# EAGLE design Controller (EAGLE 9.6.2)
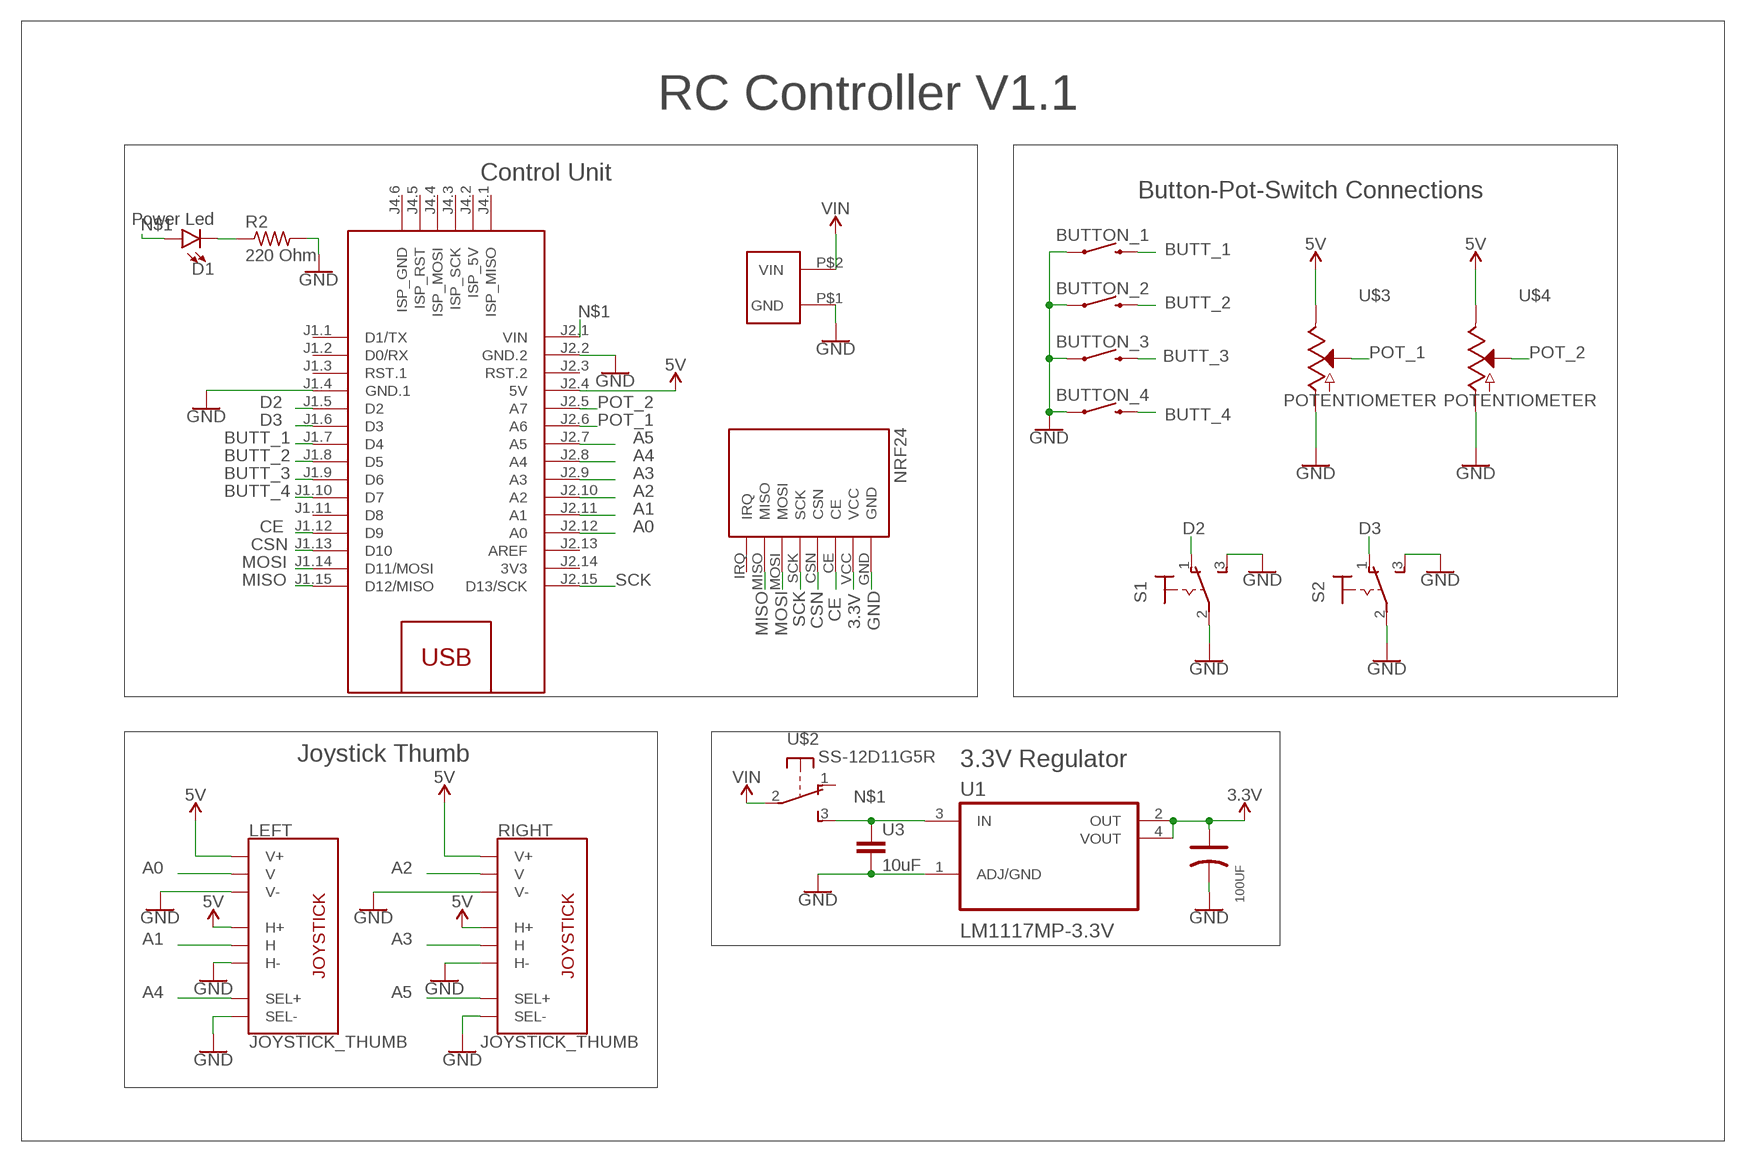
[diagram p0: schematic, sheet 1]

## Parts
BUTTON_1  MOMENTARY-SWITCH-SPST-PTH-6.0MM  [TACTILE_SWITCH_PTH_6.0MM]
BUTTON_2  MOMENTARY-SWITCH-SPST-PTH-6.0MM  [TACTILE_SWITCH_PTH_6.0MM]
BUTTON_3  MOMENTARY-SWITCH-SPST-PTH-6.0MM  [TACTILE_SWITCH_PTH_6.0MM]
BUTTON_4  MOMENTARY-SWITCH-SPST-PTH-6.0MM  [TACTILE_SWITCH_PTH_6.0MM]
D1  Power Led  LED-RED1206  [LED-1206]
LEFT  JOYSTICK_THUMB  [JOYSTICK]
M1  ARDUINO-NANO-3.0#ISP  [ARDUINO-NANO-3.0#ISP]
R2  220 Ohm  ERJ-8GEY0R00V  [RES_1206]
RIGHT  JOYSTICK_THUMB  [JOYSTICK]
S1  320-916  [320-916]
S2  320-916  [320-916]
U1  LM1117MP-3.3V  LM1117MP-5.0  [SOT230P700X180-4N]
U2  100UF  [8X10MM]
U3  10uF  10UF-1206-6.3V-20%  [1206]
U$1  VIN  [SMD_VIN]
U$2  SS-12D11G5R  [SWITCH]
U$3  POTENTIOMETER  [POTENTIOMETER]
U$4  POTENTIOMETER  [POTENTIOMETER]
U$5  NRF24  [NRF24]

## Nets
3.3V: U1.2(OUT) U1.4(VOUT) U2.1(+) U$5.VCC
5V: LEFT.H1(H+) LEFT.V1(V+) M1.J2.4(5V) RIGHT.H1(H+) RIGHT.V1(V+) U$3.1 U$4.1
A0: LEFT.V2(V) M1.J2.12(A0)
A1: LEFT.H2(H) M1.J2.11(A1)
A2: M1.J2.10(A2) RIGHT.V2(V)
A3: M1.J2.9(A3) RIGHT.H2(H)
A4: LEFT.B1A(SEL+) M1.J2.8(A4)
A5: M1.J2.7(A5) RIGHT.B1A(SEL+)
BUTT_1: BUTTON_1.3 M1.J1.7(D4)
BUTT_2: BUTTON_2.3 M1.J1.8(D5)
BUTT_3: BUTTON_3.3 M1.J1.9(D6)
BUTT_4: BUTTON_4.3 M1.J1.10(D7)
CE: M1.J1.12(D9) U$5.CE
CSN: M1.J1.13(D10) U$5.CSN
D2: M1.J1.5(D2) S1.1(O)
D3: M1.J1.6(D3) S2.1(O)
GND: BUTTON_1.1 BUTTON_2.1 BUTTON_3.1 BUTTON_4.1 LEFT.B2A(SEL-) LEFT.H3(H-) LEFT.V3(V-) M1.J1.4(GND.1) M1.J2.2(GND.2) R2.2 RIGHT.B2A(SEL-) RIGHT.H3(H-) RIGHT.V3(V-) S1.2(P) S1.3(S) S2.2(P) S2.3(S) U1.1(ADJ/GND) U2.2(-) U3.2 U$1.P$1(GND) U$3.3 U$4.3 U$5.GND
MISO: M1.J1.15(D12/MISO) U$5.MISO
MOSI: M1.J1.14(D11/MOSI) U$5.MOSI
N$1: D1.A M1.J2.1(VIN) U1.3(IN) U3.1 U$2.3(S)
N$2: D1.C R2.1
POT_1: M1.J2.6(A6) U$3.2
POT_2: M1.J2.5(A7) U$4.2
SCK: M1.J2.15(D13/SCK) U$5.SCK
VIN: U$1.P$2(VIN) U$2.2(P)
Unconnected: M1.J1.1(D1/TX) M1.J1.2(D0/RX) M1.J1.3(RST.1) M1.J1.11(D8) M1.J2.3(RST.2) M1.J2.13(AREF) M1.J4.1(ISP_MISO) M1.J4.2(ISP_5V) M1.J4.3(ISP_SCK) M1.J4.4(ISP_MOSI) M1.J4.5(ISP_RST) M1.J4.6(ISP_GND) U$2.1(O) U$5.IRQ

## Notes on the sheet
- RC Controller V1.1
- Control Unit
- Button-Pot-Switch Connections
- Joystick Thumb | 3.3V Regulator

## Power pins joined to a net without a drawn wire
3V3: M1.J2.14(3V3)

## Library data of the parts
BUTTON_1-BUTTON_4 = SparkFun-Switches:MOMENTARY-SWITCH-SPST: Momentary Switch (Pushbutton) - SPST Normally-open (NO) SPST momentary switches (buttons, pushbuttons). Variants PTH-12MM - 12mm square, through-hole Momentary Pushbutton Switch - 12mm Square <https://www.sparkfun.com/products/9190> (COM-09190) PTH-6.0MM, PTH-6.0MM-KIT - 6.0mm square, through-hole Mini Pushbutton Switch <https://www.sparkfun.com/products/97> (COM-00097) KIT package intended for soldering kit's - only one side of pads' copper is exposed. PTH-RIGHT-ANGLE-KIT - Right-angle, through-hole Right Angle Tactile Button <https://www.sparkfun.com/products/10791> - Used on SparkFun BigTime Watch Kit <https://www.sparkfun.com/products/11734> SMD-12MM - 12mm square, surface-mount Tactile Button - SMD (12mm) <https://www.sparkfun.com/products/12993> (COM-12993) Used on SparkFun PicoBoard <https://www.sparkfun.com/products/11888> SMD-4.5MM - 4.5mm Square Trackball Switch Used on SparkFun Blackberry Trackballer Breakout <https://www.sparkfun.com/products/13169> SMD-4.6MMX2.8MM - 4.60mm x 2.80mm, surface mount Used on SparkFun SAMD21 Mini Breakout <https://www.sparkfun.com/products/13664> SMD-5.2MM, SMD-5.2-REDUNDANT - 5.2mm square, surface-mount Mini Pushbutton Switch - SMD <https://www.sparkfun.com/products/8720> (COM-08720) Used on Arduino Pro Mini <https://www.sparkfun.com/products/11114> REDUNDANT package connects both switch circuits together SMD-6.0X3.5MM - 6.0 x 3.5mm, surface mount Momentary Reset Switch SMD <https://www.sparkfun.com/products/8229> (COM-08229) SMD-6.2MM-TALL - 6.2mm square, surface mount Tactile Button - SMD (6mm) <https://www.sparkfun.com/products/12992> Used on SparkFun Digital Sandbox <https://www.sparkfun.com/products/12651> SMD-RIGHT-ANGLE - Right-angle, surface mount Used on SparkFun Block for Intel® Edison - Arduino <https://www.sparkfun.com/products/13036>; PROD_ID: SWCH-08441; SF_SKU: COM-00097
D1 = SparkFun-LED:LED-RED: Red SMD LED Used in manufacturing of most products at SparkFun Packages: 0603 - SMD 0603 package [Product Link] <http://docs.avagotech.com/docs/AV02-0551EN> 0603 SMART - SMD 0603 SMART package ( more efficient and expensive)[Product Link] <http://www.osram-os.com/Graphics/XPic2/00077099_0.pdf> 1206 - SMD1206 package [Product Link] <https://www.sparkfun.com/datasheets/DevTools/LilyPad/Q150OVS4.pdff> SparkFun Products: Pro Mini 328 -5V <https://www.sparkfun.com/products/821> RedBoard <https://www.sparkfun.com/products/12757> IOIO-OTG <https://www.sparkfun.com/products/13613>; PROD_ID: DIO-09912; VALUE: RED
LEFT RIGHT = SparkFun-Switches:JOYSTICK_THUMB: Analog Thumb Joystick This is a joystick very similar to the ‘analog’ joysticks on PS2 (PlayStation 2) controllers. Directional movements are simply two potentiometers - one for each axis. Pots are ~10k each. This joystick also has a select button that is actuated when the joystick is pressed down. SparkFun Products Thumb Joystick <https://www.sparkfun.com/products/9032> (COM-09032) SparkFun Thumb Joystick Breakout <https://www.sparkfun.com/products/9110> (BOB-09110) SparkFun Joystick Shield Kit <https://www.sparkfun.com/products/9760> (DEV-09760); PROD_ID: COMP-09744; SF_SKU: COM-09032
M1 = diy-modules:ARDUINO-NANO-3.0#ISP: Arduino Nano 3.0 with ISP pads
R2 = Resistor_Capacitor:ERJ-8GEY0R00V: RES SMD 0 OHM JUMPER 1/4W 1206 Manufacturer's datasheet <https://industrial.panasonic.com/ww/products/resistors/chip-resistors/general-purpose-chip-resistors/thick-film-chip-resistors/ERJ8GEY0R00V>; CREATED_BY: PCBLayout.com; DIGIKEY_PART_NUMBER: P0.0ETR-ND; MANUFACTURER: Panasonic Electronic Components; MPN: ERJ-8GEY0R00V; PACKAGE: SMD 1206
S1 S2 = nrf24:320-916: TOGGLE SWITCH distributor RS Components
U1 = SnapEDA Library:LM1117MP-5.0
U2 = nrf24:100UF
U3 = SparkFun-Capacitors:10UF: 10.0µF ceramic capacitors A capacitor is a passive two-terminal electrical component used to store electrical energy temporarily in an electric field.; PROD_ID: CAP-10057
U$1 = nrf24:VIN
U$2 = nrf24:SS-12D11G5R
U$3 U$4 = nrf24:POTENTIOMETER
U$5 = nrf24:NRF24

## Net classes
0 default: width 0.61 mm

## Board
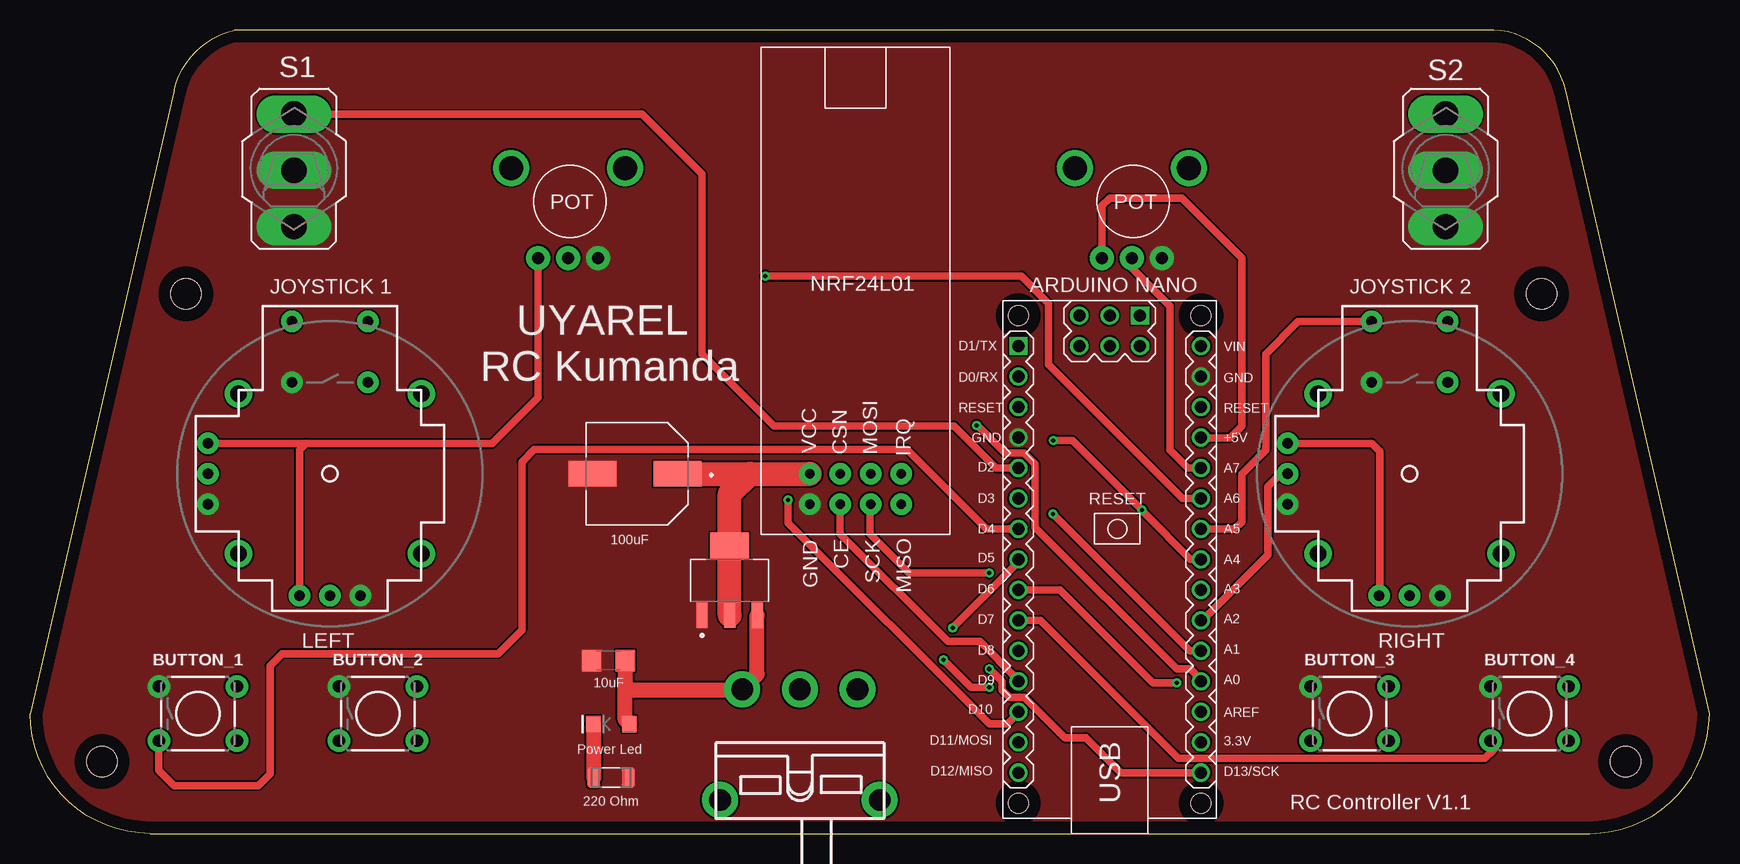
[diagram p1: board, top side]
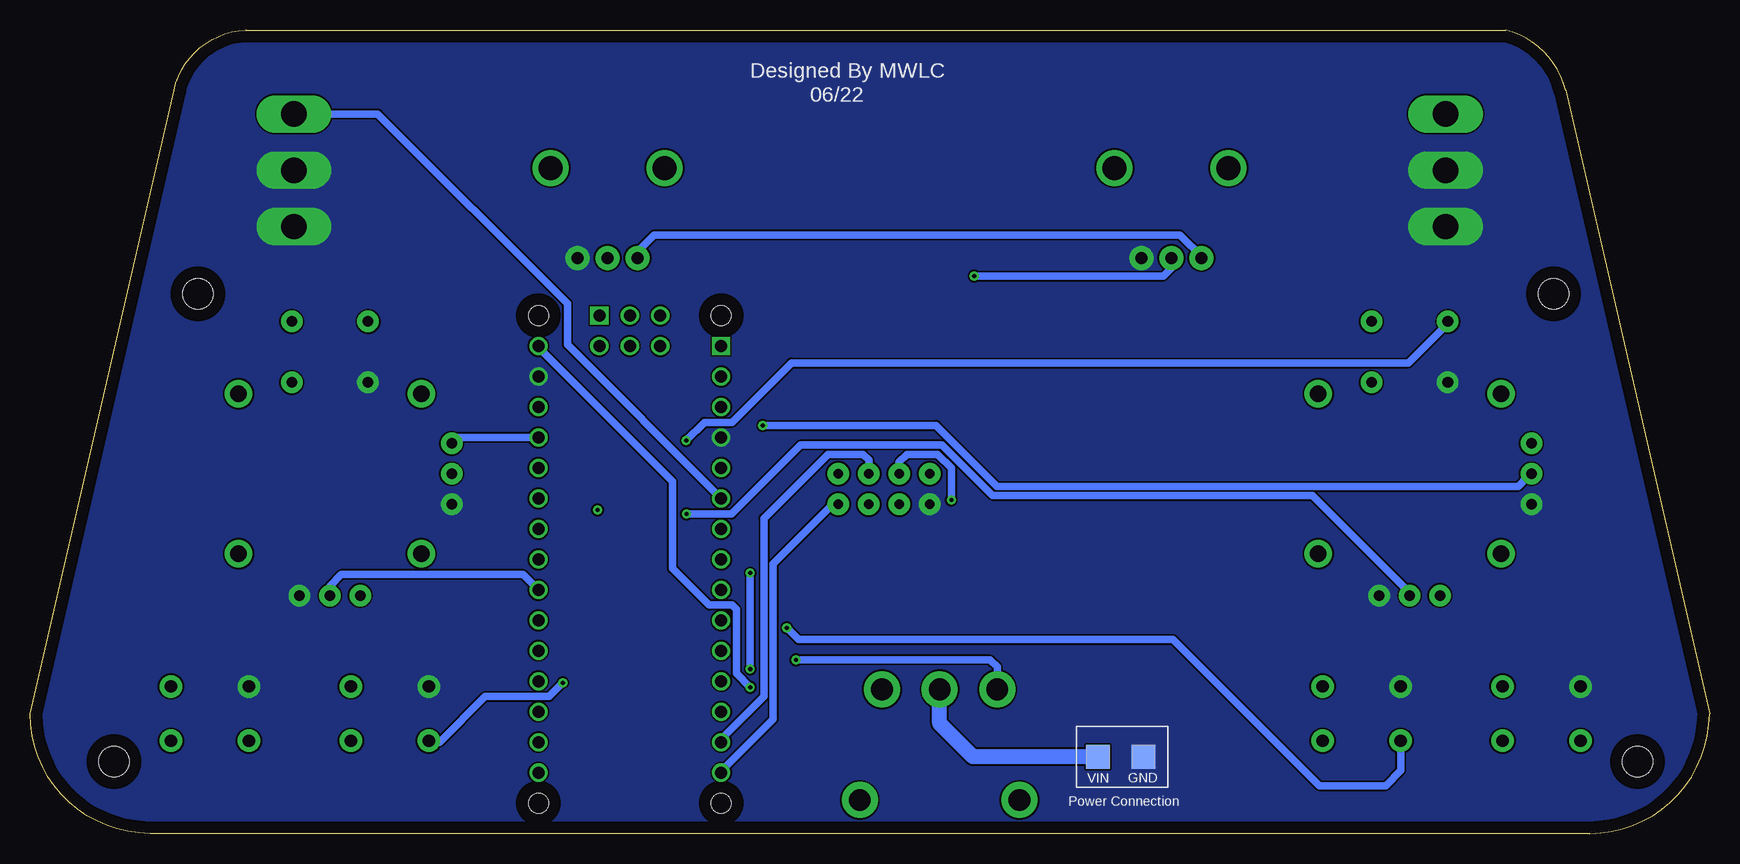
[diagram p2: board, bottom side, seen from below]

Size 140 x 67 mm. Coordinates in mm from the lower left corner, seen from the top.
Outline: 122,67 arc-74 128,62 140,10 arc-90 130,0 10,0 arc-90 0,10 12,62 arc-61 17,67 122,67
Outline: 122,67 122.03,67
Copper layers (1*16): Top 0.035mm / dielectric 1.5mm / Bottom 0.035mm
Design rules "default": minimum track width 6mil, minimum drill 0.35mm, track to track 6mil, track to pad 6mil, pad to pad 6mil, via to via 6mil, smd to smd 6mil, copper to edge 40mil, drill to drill 6mil, minimum pad ring 10mil, minimum via ring 8mil, stop-mask expansion 4mil, vias tented up to drill 0mil, thermal gap 10mil
Holes 2.5 mm at 13,45 6,6 126,45 133,6

### Footprints (pad centres in the part's own frame; a part is rotated, then mirrored left to right if it is on the bottom)
TACTILE_SWITCH_PTH_6.0MM = drill 1.016 pad 1.88: 1 -3.251,2.261; 2 3.251,2.261; 3 -3.251,-2.261; 4 3.251,-2.261
LED-1206 = smd 1.2 x 1.4: A -1.5,0; C 1.5,0
JOYSTICK = drill 0.9 pad 1.778: B1A -3.175,12.7; B1B 3.175,12.7; B2A -3.175,7.62; B2B 3.175,7.62 | drill 0.889 pad 1.778: H1 -2.54,-10.16; H2 0,-10.16; H3 2.54,-10.16; V1 -10.16,2.54; V2 -10.16,0; V3 -10.16,-2.54 | drill 1.397 pad 2.286: MOUNT1 -7.62,6.668; MOUNT2 -7.62,-6.668; MOUNT3 7.62,-6.668; MOUNT4 7.62,6.668
ARDUINO-NANO-3.0#ISP = drill 1 square: J1.1 17.78,7.62; J4.1 20.32,-2.54 | drill 1: J1.2 15.24,7.62; J1.3 12.7,7.62; J1.4 10.16,7.62; J1.5 7.62,7.62; J1.6 5.08,7.62; J1.7 2.54,7.62; J1.8 0,7.62; J1.9 -2.54,7.62; J1.10 -5.08,7.62; J1.11 -7.62,7.62; J1.12 -10.16,7.62; J1.13 -12.7,7.62; J1.14 -15.24,7.62; J1.15 -17.78,7.62; J2.1 17.78,-7.62; J2.2 15.24,-7.62; J2.3 12.7,-7.62; J2.4 10.16,-7.62; J2.5 7.62,-7.62; J2.6 5.08,-7.62; J2.7 2.54,-7.62; J2.8 0,-7.62; J2.9 -2.54,-7.62; J2.10 -5.08,-7.62; J2.11 -7.62,-7.62; J2.12 -10.16,-7.62; J2.13 -12.7,-7.62; J2.14 -15.24,-7.62; J2.15 -17.78,-7.62; J4.2 17.78,-2.54; J4.3 20.32,0; J4.4 17.78,0; J4.5 20.32,2.54; J4.6 17.78,2.54 | hole 1.651: -20.32,7.62; -20.32,-7.62; 20.32,-7.62; 20.32,7.62
RES_1206 = smd 1.08 x 1.68: 1 -1.445,0; 2 1.445,0
320-916 = drill 2.1 long: 1 0,0; 2 4.7,0; 3 9.4,0
SOT230P700X180-4N = smd 2.15 x 0.95: 1 -2.9,2.3; 2 -2.9,0; 3 -2.9,-2.3 | smd 2.15 x 3.25: 4 2.9,0
8X10MM = smd 4 x 2.1: 1 0.01,0; 2 7.09,0
1206 = smd 1.6 x 1.8: 1 -1.4,0; 2 1.4,0
SMD_VIN = smd 2 x 2: P$1 -0.508,0; P$2 3.302,0
SWITCH = drill 1.803 pad 2.997: 1 0.025,-0.025; 2 4.826,-0.025; 3 9.627,-0.025; 4 11.481,9.195; 5 -1.829,9.195
POTENTIOMETER = drill 1 pad 2: 1 0,0; 2 2.5,0; 3 5,0 | drill 2 pad 3: P$1 -2.25,7.5; P$2 7.25,7.5
NRF24 = drill 0.8 pad 1.8: CE 2.54,-2.54; CSN 2.54,0; GND 0,-2.54; IRQ 7.62,0; MISO 7.62,-2.54; MOSI 5.08,0; SCK 5.08,-2.54; VCC 0,0

### Placement (x,y rotation side)
BUTTON_1  14,10 0 top
BUTTON_2  29,10 0 top
BUTTON_3  110,10 0 top
BUTTON_4  125,10 0 top
D1  48.47,9.13 180 top
LEFT  25,30 0 top
M1  90,22.86 90 top
R2  48.44,4.67 0 top
RIGHT  115,30 0 top
S1  22,60 270 top
S2  118,60 270 top
U1  58.32,21.12 90 top
U2  54,30 180 top
U3  48.22,14.42 180 top
U$1  47.7,6.4 180 bottom
U$2  69,12 180 top
U$3  42.36,48 0 top
U$4  89.35,48 0 top
U$5  65,30 0 top

### Tracks (layer width: path | path; a pad name or v marks a point on that pad's centre or on a via)
3.3V
  Top 2: 60,30 U$5.VCC | 60,30 58.32,28.32 U1.4 U1.2 | U2.1 60,30
5V
  Top 0.61: RIGHT.V1 111.84,32.54 112.51,31.87 112.51,19.89 RIGHT.H1 | LEFT.V1 23,32.54 | 23,32.54 38.54,32.54 42.36,36.36 U$3.1 | LEFT.H1 22.46,32 23,32.54 | M1.J2.4 97.64,33 100,33 101,34 101,48 96,53 90,53 89.35,52.35 U$4.1
  Bottom 0.61: U$3.1 42.24,48.01 44.15,49.91 87.96,49.91 89.35,48.52 U$4.1 | M1.J2.4 104.36,33.02 RIGHT.V1
A0  (via drill 0.35)
  Top 0.61: M1.J2.12 97.49,12.95 96.73,13.72 95.58,13.72 83.77,25.53 83.77,30.8 82.84,31.73 81.27,31.73 79,34 78.94,34 v78.92,34.03
  Bottom 0.61: v78.92,34.03 64.46,34.03 59.39,28.96 15.95,28.96 15.19,29.72 LEFT.V2
A1  (via drill 0.35)
  Top 0.61: v85.28,26.64 96.68,15.24 M1.J2.11
  Bottom 0.61: LEFT.H2 25.1,20.19 33.1,28.19 59.77,28.19 63.96,32.38 75.77,32.38 81.51,26.64 v85.28,26.64
A2
  Top 0.61: M1.J2.10 97.87,17.91 103.2,23.24 103.2,28.96 103.97,29.72 104.73,29.72 RIGHT.V2
A3
  Bottom 0.61: M1.J2.9 98.89,21.59 114.05,21.59 115,20.64 RIGHT.H2
A4  (via drill 0.35)
  Top 0.61: M1.J2.8 97.87,22.86 97.49,23.24 97.11,22.86 96.73,22.86 92.92,26.67 v92.69,26.98 86.9,32.77 v85.3,32.77
  Bottom 0.61: v85.3,32.77 83.77,34.29 81.49,34.29 76.53,39.24 25.1,39.24 22.05,42.29 22.05,42.67 LEFT.B1A
A5
  Top 0.61: RIGHT.B1A 105.7,42.7 103,40 103,32 101,30 101,26 100.4,25.4 M1.J2.7
BUTT_1
  Top 0.61: M1.J1.7 79.71,25.4 73.11,32 42,32 41,31 41,17 39,15 21,15 20,14 20,5 19,4 12,4 10.75,5.25 BUTTON_1.3
BUTT_2  (via drill 0.35)
  Top 0.61: v76.92,17.14 82.25,22.48 82.25,22.86 M1.J1.8
  Bottom 0.61: v76.92,17.14 75.95,16.18 44.71,16.18 32.53,4 27,4 25.75,5.25 BUTTON_2.3
BUTT_3  (via drill 0.35)
  Top 0.61: v95.58,12.57 93.58,12.57 85.84,20.32 M1.J1.9
  Bottom 0.61: v95.58,12.57 96.73,11.43 102.06,11.43 105.87,7.62 106.63,7.62 BUTTON_3.3
BUTT_4
  Top 0.61: M1.J1.10 84.22,17.78 95.71,6.29 121.29,6.29 122,7 122,7.49 BUTTON_4.3
CE
  Top 0.61: M1.J1.12 82.25,12.95 79.2,16 76.53,16 67.54,25 U$5.CE
CSN  (via drill 0.35)
  Top 0.61: v63.2,27.81 63.2,25.91 79.96,9.14 81.49,9.14 82.25,9.91 M1.J1.13
  Bottom 0.61: v63.2,27.81 63.2,30.48 64.34,31.62 66.89,31.62 67.55,30.96 U$5.CSN
D2
  Top 0.61: S1.1 51,60 56,55 56,40 62,34 77,34 80.52,30.48 M1.J1.5
D3
  Bottom 0.61: M1.J1.6 82.63,28.19 95.2,40.77 95.2,44.2 111.01,60 S2.1
GND
  pour Top (no thermals): 122,67 17,67 arc90 12,62 0,10 arc116 10,0 130,0 arc90 140,10 128,62 arc74
  pour Bottom (no thermals): 18,67 122,67 arc-80 128,62 140,10 arc-116 130,0 9,0 arc-96 0,10 11.7,60.7 arc-64
MISO
  Bottom 0.61: M1.J1.15 82.25,5.33 78.06,9.53 78.06,22.48 72.72,27.81 U$5.MISO
MOSI
  Bottom 0.61: M1.J1.14 82.25,7.62 82.25,8 78.82,11.43 78.82,26.29 73.49,31.62 70.55,31.62 70.08,31.15 U$5.MOSI
N$1  (via drill 0.35)
  Top 0.61: v79.96,12.19 78.44,12.19 v76.15,14.48
  Top 1.27: U3.1 49.62,12.38 | 49.62,12.38 50,12 59.35,12 U$2.3 60.62,13.27 U1.3 | D1.A 49.62,9.48 49.62,12.38
  Bottom 0.61: v79.96,12.19 81.11,13.34 81.11,18.67 81.49,19.05 83.39,19.05 86.44,22.1 86.44,29.34 97.49,40.39 M1.J2.1 | v76.15,14.48 59.97,14.48 59.37,13.88 U$2.3
N$2
  Top 1.27: D1.C 46.99,9.11 R2.1
POT_1  (via drill 0.35)
  Top 0.61: v61.29,46.48 82.63,46.48 84.92,44.2 84.92,39.08 96.06,27.94 M1.J2.6
  Bottom 0.61: U$3.2 44.86,47.14 45.52,46.48 v61.29,46.48
POT_2
  Top 0.61: M1.J2.5 96.52,30.48 95,32 95,44 91.85,47.15 U$4.2
SCK  (via drill 0.35)
  Top 0.61: U$5.SCK 70,27.38 70,25 73.28,21.72 v79.96,21.72 | v79.96,13.72 81,12.68 81,12 81.63,11.37 82.88,11.37 86.25,8 88,8 90.92,5.08 M1.J2.15
  Bottom 0.61: v79.96,21.72 v79.96,13.72
VIN
  Bottom 1.27: U$1.P$2 61.4,6.4 64.17,9.17 U$2.2

### Text on the board
tNames: JOYSTICK 1 | ARDUINO NANO | JOYSTICK 2 | D1/TX | VIN | UYAREL / RC Kumanda | D0/RX | GND | RESET | RESET | GND | +5V | VCC | CSN | MOSI | IRQ | D2 | A7 | D3 | A6 | D4 | A5 | 100uF | D5 | CE | A4 | SCK | GND | MISO | D6 | A3 | A2 | D7 | D8 | A1 | 10uF | D9 | A0 | D10 | AREF | Power Led | D11/MOSI | 3.3V | D12/MISO | D13/SCK | 220 Ohm | RC Controller V1.1
bNames: Designed By MWLC | 06/22 | GND | VIN | Power Connection